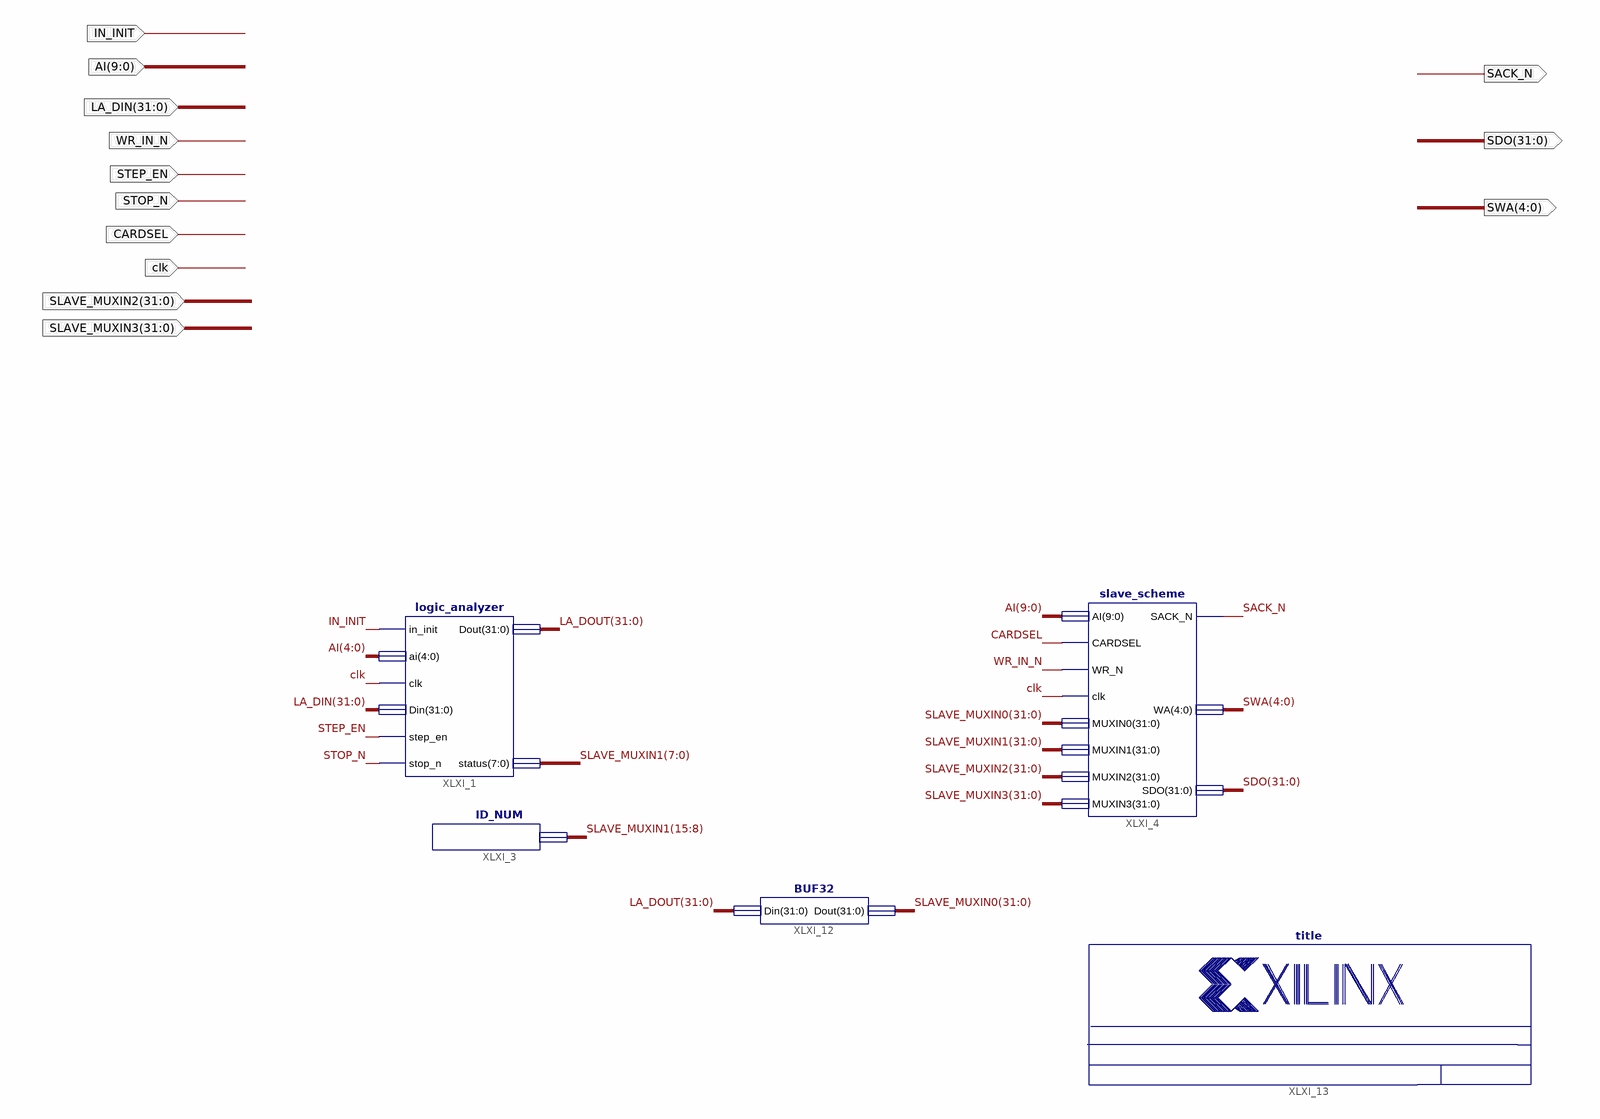
[diagram p0: schematic sheet 1]
// Xilinx ISE schematic monitor.sch (spartan6) as structural Verilog: 5 symbols, 13 ports
module monitor (
  input  clk,
  input  [31:0] SLAVE_MUXIN2,
  input  [31:0] SLAVE_MUXIN3,
  input  IN_INIT,
  input  [9:0] AI,
  input  [31:0] LA_DIN,
  input  STEP_EN,
  input  STOP_N,
  input  CARDSEL,
  input  WR_IN_N,
  output SACK_N,
  output [4:0] SWA,
  output [31:0] SDO
);

  wire [31:0] LA_DOUT, SLAVE_MUXIN0, SLAVE_MUXIN1;

  logic_analyzer XLXI_1 (
    .in_init(IN_INIT), .ai(AI[4:0]), .clk(clk), .Din(LA_DIN), .step_en(STEP_EN), .stop_n(STOP_N),
    .Dout(LA_DOUT), .status(SLAVE_MUXIN1[7:0]));
  ID_NUM XLXI_3 (.ID(SLAVE_MUXIN1[15:8]));
  slave_scheme XLXI_4 (
    .AI(AI), .CARDSEL(CARDSEL), .WR_N(WR_IN_N), .clk(clk), .MUXIN0(SLAVE_MUXIN0), .MUXIN2(SLAVE_MUXIN2),
    .MUXIN3(SLAVE_MUXIN3), .MUXIN1(SLAVE_MUXIN1), .SACK_N(SACK_N), .WA(SWA), .SDO(SDO));
  BUF32 XLXI_12 (.Din(LA_DOUT), .Dout(SLAVE_MUXIN0));
  title #(.TitleFieldText("Lab 4 - Monitor"), .NameFieldText("Nizar_Khalaila_212683932_Reaal_Abuhoof_208866145")) XLXI_13 ();
endmodule
